# EAGLE design NSE2022 Electro_ESPtest ver.1 (EAGLE 9.6.2)
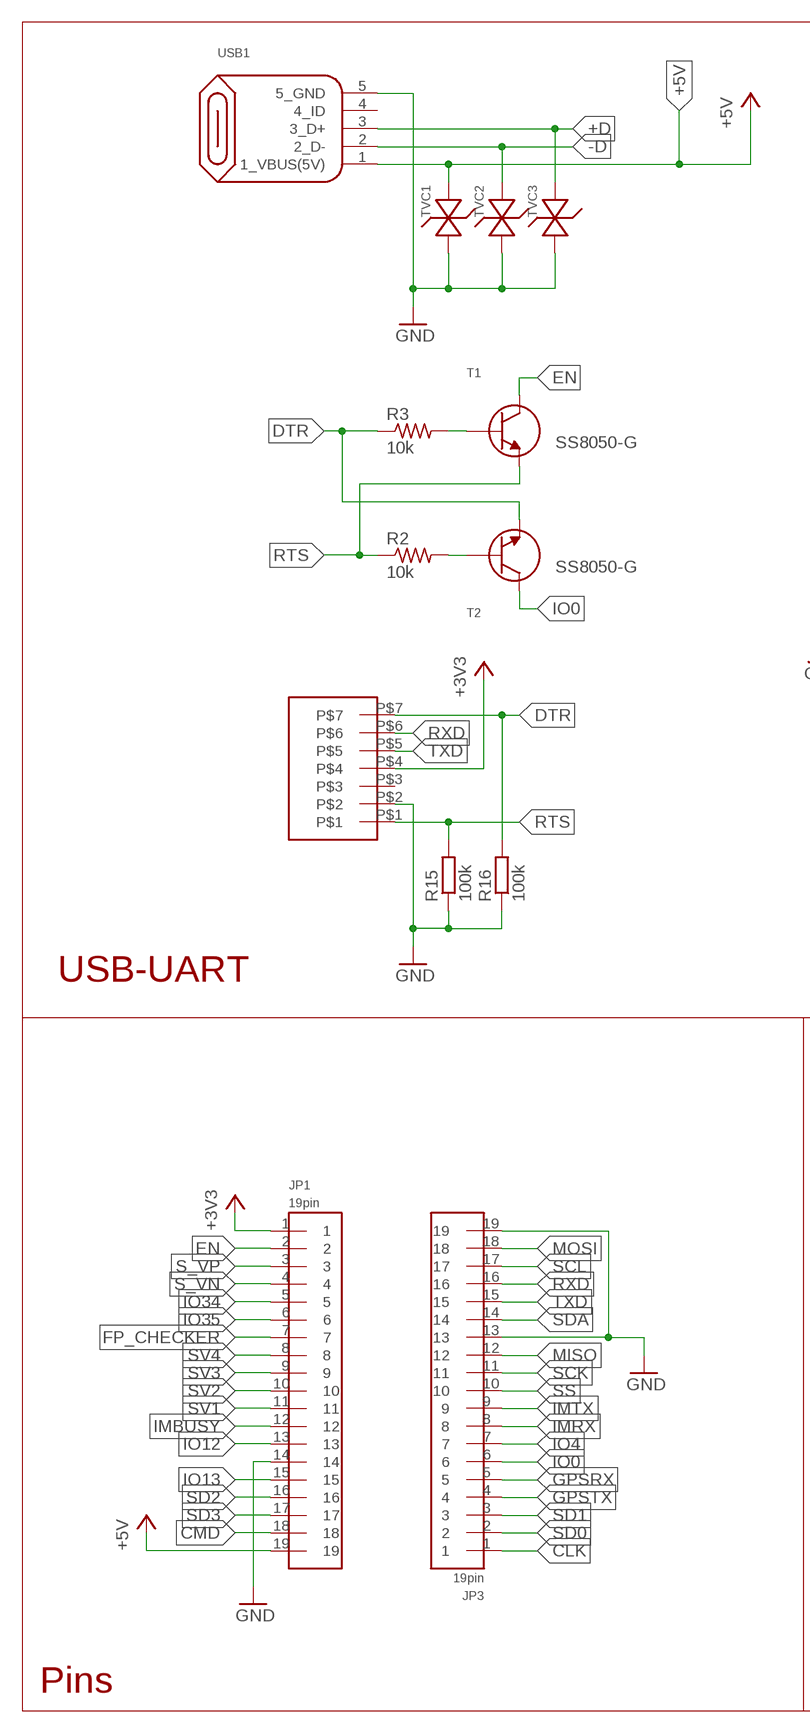
[diagram p0: schematic, sheet 1, part 1 of 2]
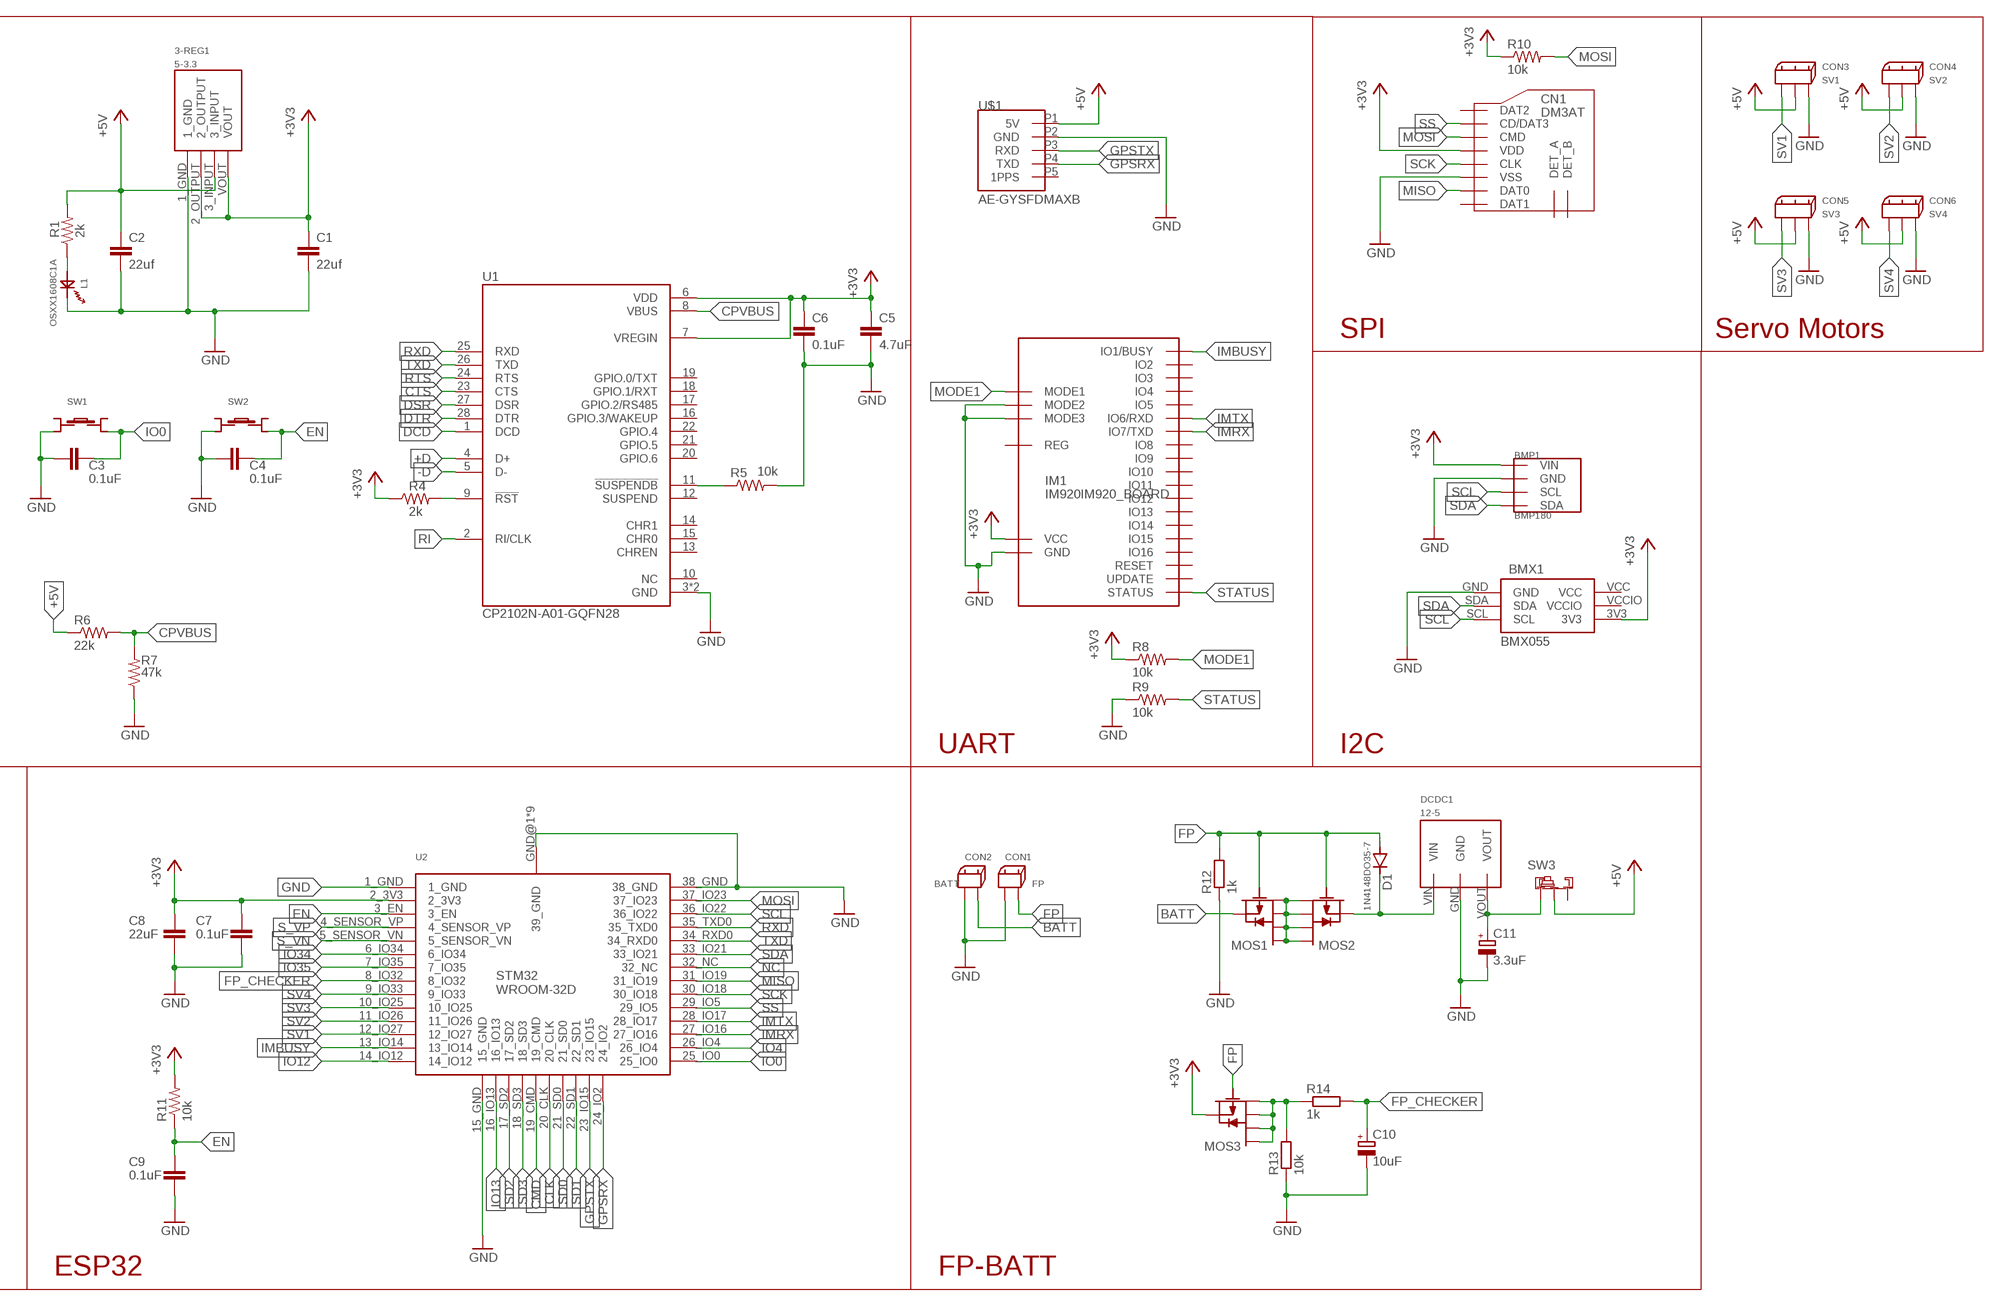
[diagram p1: schematic, sheet 1, part 2 of 2]

## Parts
3-REG1  5-3.3  AZ1117CH-3.3TRG1  [AZ1117CH-3.3TRG1]
BMP1  BMP180  [GY-68]
BMX1  BMX055  [BMX055]
C1  22uf  C-EUC0603  [C0603]
C2  22uf  C-EUC0603  [C0603]
C3  0.1uF  C-EUC0603  [C0603]
C4  0.1uF  C-EUC0603  [C0603]
C5  4.7uF  C-EUC0402  [C0402]
C6  0.1uF  C-EUC0603  [C0603]
C7  0.1uF  C-EUC0603  [C0603]
C8  22uF  C-EUC0603  [C0603]
C9  0.1uF  C-EUC0603  [C0603]
C10  10uF  CPOL-EUE2.5-5  [E2,5-5]
C11  3.3uF  CPOL-EUE2.5-5  [E2,5-5]
CN1  DM3AT  [DM3AT]
CON1  FP  2.5_MINI-SPOX_2PIN  [2.5_MINI-SPOX_2PIN]
CON2  BATT  2.5_MINI-SPOX_2PIN  [2.5_MINI-SPOX_2PIN]
CON3  SV1  2.5_MINI-SPOX_3PIN  [2.5_MINI-SPOX_3PIN]
CON4  SV2  2.5_MINI-SPOX_3PIN  [2.5_MINI-SPOX_3PIN]
CON5  SV3  2.5_MINI-SPOX_3PIN  [2.5_MINI-SPOX_3PIN]
CON6  SV4  2.5_MINI-SPOX_3PIN  [2.5_MINI-SPOX_3PIN]
D1  1N4148DO35-7  [DO35-7]
DCDC1  12-5  5V1A_M78AR05-1  [5V1A_M78AR05-1]
IM1  IM920IM920_BOARD  [IM920_BOARD]
JP1  19pin  19_2.54  [19_2.54]
JP2  7pin  7_2.54  [7_2.54]
JP3  19pin  19_2.54  [19_2.54]
L1  OSXX1608C1A  [OSXX1608C1A]
MOS1  PCH_SSM6J808R  [SSM6J808R]
MOS2  PCH_SSM6J808R  [SSM6J808R]
MOS3  PCH_SSM6J808R  [SSM6J808R]
R1  2k  R-US_R0201  [R0201]
R2  10k  R-US_R0201  [R0201]
R3  10k  R-US_R0201  [R0201]
R4  2k  R-US_R0201  [R0201]
R5  10k  R-US_R0201  [R0201]
R6  22k  R-US_R0201  [R0201]
R7  47k  R-US_R0201  [R0201]
R8  10k  R-US_R0201  [R0201]
R9  10k  R-US_R0201  [R0201]
R10  10k  R-US_R0201  [R0201]
R11  10k  R-US_R0201  [R0201]
R12  1k  R-EU_0207/10  [0207/10]
R13  10k  R-EU_0207/10  [0207/10]
R14  1k  R-EU_0207/10  [0207/10]
R15  100k  R-EU_0207/10  [0207/10]
R16  100k  R-EU_0207/10  [0207/10]
SW1  TS-06104  [TS-06104]
SW2  TS-06104  [TS-06104]
SW3  SRIDE_SWITCH  [SRIDE_SWITCH]
T1  NPN_SS8050-G  [NPN_SS8050-G]
T2  NPN_SS8050-G  [NPN_SS8050-G]
TVC1  ESD5484FCT5G  [ESD5484FCT5G]
TVC2  ESD5484FCT5G  [ESD5484FCT5G]
TVC3  ESD5484FCT5G  [ESD5484FCT5G]
U1  CP2102N-A01-GQFN28  [QFN50P500X500X80-29N]
U2  ESP32-WROOM-32D  [ESP32-WROOM-32D]
U$1  AE-GYSFDMAXB  [AE-GYSFDMAXB]
USB1  MICRO-B_ZX62R-B-5P  [MICRO-B_ZX62R-B-5P]

## Nets
+3V3 [esp]: 3-REG1.2_OUTPUT 3-REG1.VOUT BMP1.P1(VIN) BMX1.3V3 C1.1 C5.1 C6.1 C7.1 C8.1 CN1.VDD IM1.IO23(VCC) JP1.1 JP2.P$4 MOS3.S R4.1 R8.1 R10.1 R11.2 U1.6(VDD) U1.7(VREGIN) U2.2_3V3
+5V [esp]: 3-REG1.3_INPUT C2.1 CON3.2 CON4.2 CON5.2 CON6.2 JP1.19 R1.2 R6.1 SW3.LR TVC1.2_AN U$1.P1(5V) USB1.1(1_VBUS(5V))
+D [esp]: TVC3.2_AN U1.4(D+) USB1.3(3_D+)
-D [esp]: TVC2.2_AN U1.5(D-) USB1.2(2_D-)
BATT: CON2.2 MOS1.S
CLK [esp]: JP3.1 U2.20_CLK
CMD [esp]: JP1.18 U2.19_CMD
CPVBUS [esp]: R6.2 R7.2 U1.8(VBUS)
CTS [esp]: U1.23(CTS)
DCD [esp]: U1.1(DCD)
DSR [esp]: U1.27(DSR)
DTR [esp]: JP2.P$7 R3.1 R16.2 T2.2 U1.28(DTR)
EN [esp]: C4.1 C9.1 JP1.2 R11.1 SW2.D T1.3 U2.3_EN
FP: CON1.2 D1.A MOS1.G MOS2.G MOS3.G R12.2
FP_CHECKER: C10.+ JP1.7 R14.2 U2.8_IO32
GND [esp]: 3-REG1.1_GND BMP1.P2(GND) BMX1.GND C1.2 C2.2 C3.2 C4.2 C5.2 C6.2 C7.2 C8.2 C9.2 C10.- C11.- CN1.VSS CON1.1 CON2.1 CON3.3 CON4.3 CON5.3 CON6.3 DCDC1.GND IM1.IO18(MODE2) IM1.IO19(MODE3) IM1.IO24(GND) JP1.14 JP2.P$2 JP3.13 JP3.19 L1.CT R5.2 R7.1 R9.1 R12.1 R13.1 R15.1 R16.1 SW1.B SW2.B TVC1.1_CT TVC2.1_CT TVC3.1_CT U1.3(GND) U1.29(GND) U2.1_GND U2.15_GND U2.38_GND U2.GND@1(39_GND) U2.GND@2(39_GND) U2.GND@3(39_GND) U2.GND@4(39_GND) U2.GND@5(39_GND) U2.GND@6(39_GND) U2.GND@7(39_GND) U2.GND@8(39_GND) U2.GND@9(39_GND) U$1.P2(GND) USB1.5(5_GND)
GPSRX: JP3.5 U2.24_IO2 U$1.P4(TXD)
GPSTX: JP3.4 U2.23_IO15 U$1.P3(RXD)
IMBUSY: IM1.IO1(IO1/BUSY) JP1.12 U2.13_IO14
IMRX: IM1.IO7(IO7/TXD) JP3.8 U2.27_IO16
IMTX: IM1.IO6(IO6/RXD) JP3.9 U2.28_IO17
IO0 [esp]: C3.1 JP3.6 SW1.D T2.3 U2.25_IO0
IO4 [esp]: JP3.7 U2.26_IO4
IO12 [esp]: JP1.13 U2.14_IO12
IO13 [esp]: JP1.15 U2.16_IO13
IO34 [esp]: JP1.5 U2.6_IO34
IO35 [esp]: JP1.6 U2.7_IO35
MISO: CN1.DAT0 JP3.12 U2.31_IO19
MODE1: IM1.IO17(MODE1) R8.2
MOSI: CN1.CMD JP3.18 R10.2 U2.37_IO23
N$1 [esp]: L1.AN R1.1
N$2 [esp]: R3.2 T1.1
N$5 [esp]: R2.2 T2.1
N$8 [esp]: R4.2 U1.9(!RST)
N$10 [esp]: R5.1 U1.11(!SUSPENDB)
N$11: D1.C DCDC1.VIN MOS2.S
N$12: MOS1.D1 MOS1.D2 MOS1.D3 MOS1.D4 MOS2.D1 MOS2.D2 MOS2.D3 MOS2.D4
N$13: C11.+ DCDC1.VOUT SW3.L
N$14: MOS3.D1 MOS3.D2 MOS3.D3 MOS3.D4 R13.2 R14.1
NC [esp]: U2.32_NC
RI [esp]: U1.2(RI/CLK)
RTS [esp]: JP2.P$1 R2.1 R15.2 T1.2 U1.24(RTS)
RXD [esp]: JP2.P$6 JP3.16 U1.25(RXD) U2.35_TXD0
S_VN [esp]: JP1.4 U2.5_SENSOR_VN
S_VP [esp]: JP1.3 U2.4_SENSOR_VP
SCK: CN1.CLK JP3.11 U2.30_IO18
SCL: BMP1.P3(SCL) BMX1.SCL JP3.17 U2.36_IO22
SD0 [esp]: JP3.2 U2.21_SD0
SD1 [esp]: JP3.3 U2.22_SD1
SD2 [esp]: JP1.16 U2.17_SD2
SD3 [esp]: JP1.17 U2.18_SD3
SDA: BMP1.P4(SDA) BMX1.SDA JP3.14 U2.33_IO21
SS: CN1.CD/DAT3 JP3.10 U2.29_IO5
STATUS: IM1.IO21(STATUS) R9.2
SV1: CON3.1 JP1.11 U2.12_IO27
SV2: CON4.1 JP1.10 U2.11_IO26
SV3: CON5.1 JP1.9 U2.10_IO25
SV4: CON6.1 JP1.8 U2.9_IO33
TXD [esp]: JP2.P$5 JP3.15 U1.26(TXD) U2.34_RXD0
Unconnected: CN1.DAT1 CN1.DAT2 CN1.DET_A CN1.DET_B IM1.IO2 IM1.IO3 IM1.IO4 IM1.IO5 IM1.IO8 IM1.IO9 IM1.IO10 IM1.IO11 IM1.IO12 IM1.IO13 IM1.IO14 IM1.IO15 IM1.IO16 IM1.IO20(UPDATE) IM1.IO22(REG) IM1.IO25(RESET) JP2.P$3 SW1.A SW1.C SW2.A SW2.C SW3.R U1.10(NC) U1.12(SUSPEND) U1.13(CHREN) U1.14(CHR1) U1.15(CHR0) U1.16(GPIO.3/WAKEUP) U1.17(GPIO.2/RS485) U1.18(GPIO.1/RXT) U1.19(GPIO.0/TXT) U1.20(GPIO.6) U1.21(GPIO.5) U1.22(GPIO.4) U$1.P5(1PPS) USB1.4(4_ID)

## Notes on the sheet
- SS8050-G | SPI | Servo Motors
- SS8050-G
- USB-UART
- UART | I2C
- Pins | ESP32 | FP-BATT

## Power pins joined to a net without a drawn wire
VCC: BMX1.VCC
VCCIO: BMX1.VCCIO

## Library data of the parts
3-REG1 = Chip 3-Terminal Regulator:AZ1117CH-3.3TRG1
BMP1 = BMP180:BMP180
BMX1 = BMX055:BMX055
C1-C9 = rcl:C-EU: CAPACITOR, European symbol; SPICEPREFIX: C
C10 C11 = rcl:CPOL-EU: POLARIZED CAPACITOR, European symbol; SPICEPREFIX: C
CN1 = microSD:DM3AT
CON1 CON2 = Connector:2.5_MINI-SPOX_2PIN
CON3-CON6 = Connector:2.5_MINI-SPOX_3PIN
D1 = diode:1N4148: DIODE high speed (Philips)
DCDC1 = DC-DC:5V1A_M78AR05-1
IM1 = IM920:IM920
JP1 JP3 = JumperPins:19_2.54
JP2 = JumperPins:7_2.54
L1 = ChipLED:OSXX1608C1A
MOS1-MOS3 = Chip MOSFET:PCH_SSM6J808R
R1-R11 = rcl:R-US_: RESISTOR, American symbol; SPICEPREFIX: R
R12-R16 = rcl:R-EU_: RESISTOR, European symbol; SPICEPREFIX: R
SW1 SW2 = Switches:TS-06104
SW3 = Switches:SRIDE_SWITCH
T1 T2 = Chip Transister:NPN_SS8050-G
TVC1-TVC3 = TVC Diode:ESD5484FCT5G
U1 = CP2102N-A01-GQFN28:CP2102N-A01-GQFN28: USB Bridge, USB to UART USB 2.0 UART Interface 28-QFN (5x5) Check availability <https://pricing.snapeda.com/parts/CP2102N-A01-GQFN28/Silicon%20Labs/view-part?ref=eda>; AVAILABILITY: In Stock; DESCRIPTION: USB Bridge, USB to UART USB 2.0 UART Interface 28-QFN (5x5); MF: Silicon Labs; MP: CP2102N-A01-GQFN28; PACKAGE: QFN-28 Silicon Labs; PRICE: None; PURCHASE-URL: https://pricing.snapeda.com/search/part/CP2102N-A01-GQFN28/?ref=eda
U2 = ESP32:ESP32-WROOM-32D
U$1 = AE-GYSFDMAXB:AE-GYSFDMAXB
USB1 = USB:MICRO-B_ZX62R-B-5P

## Net classes
0 default: drill 0.35 mm
1 esp: width 0.254 mm, drill 0.35 mm, clearance 0.025 mm

## Board
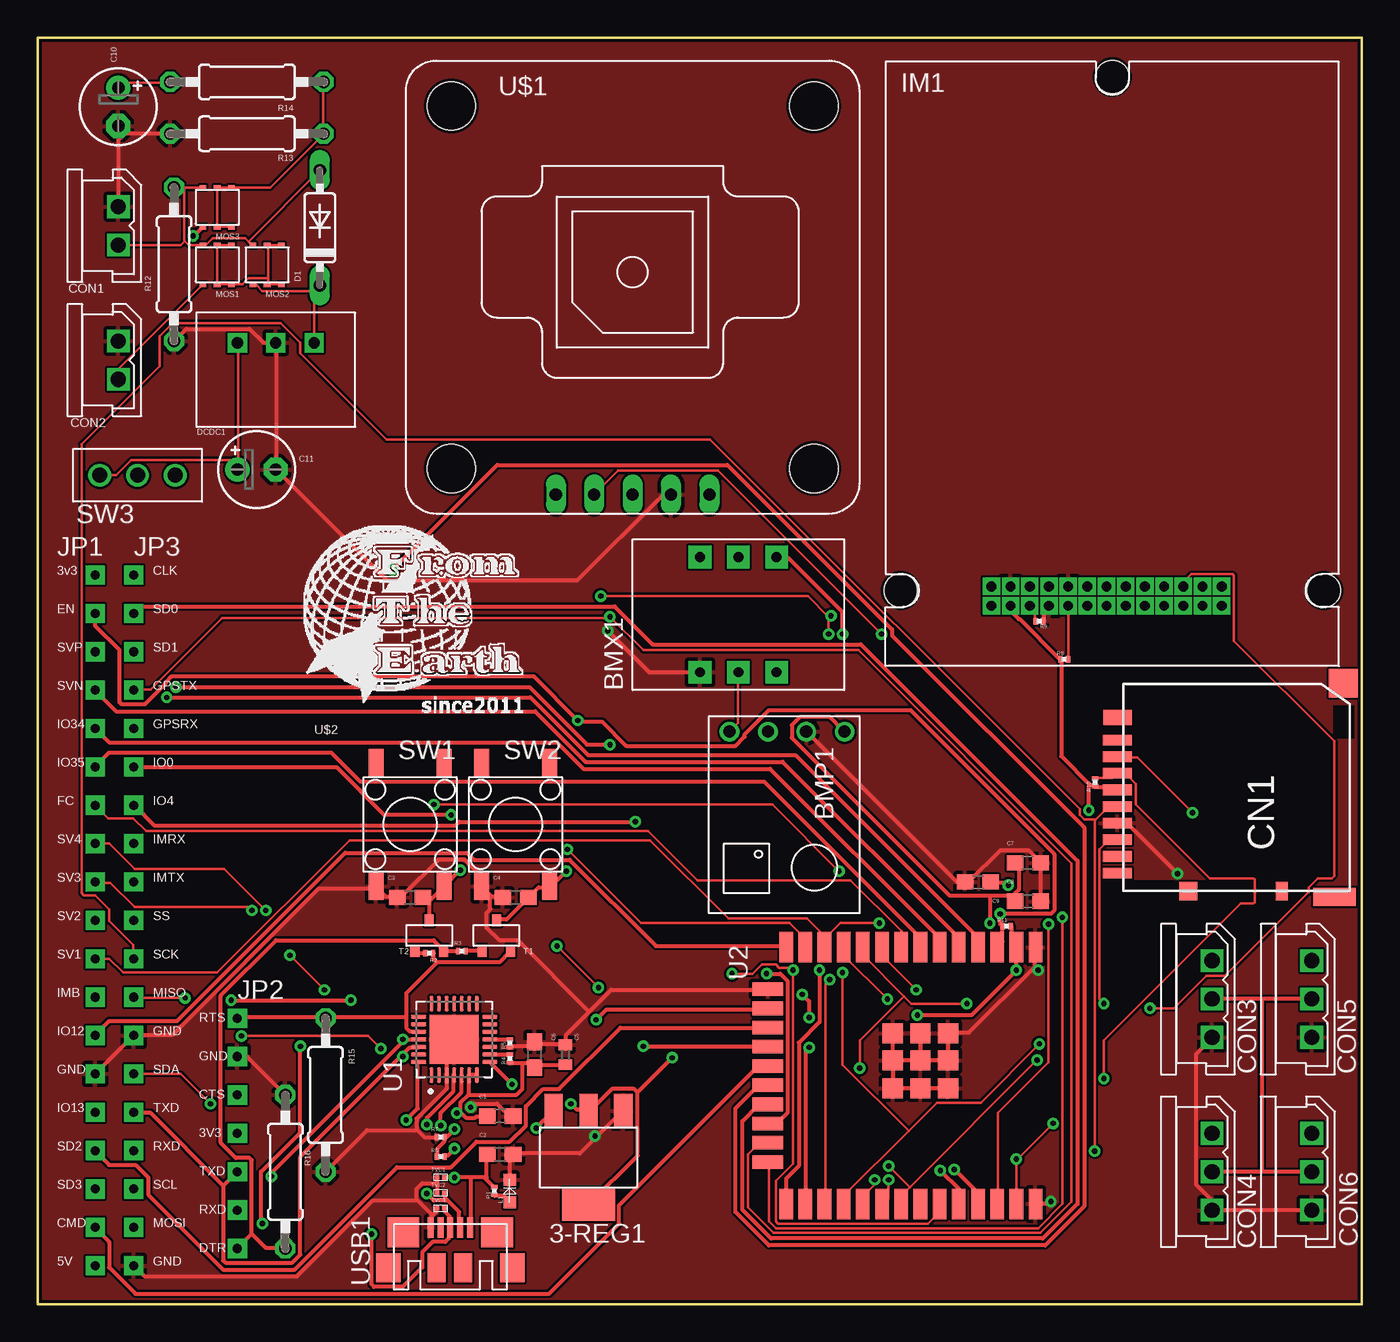
[diagram p2: board, top side]
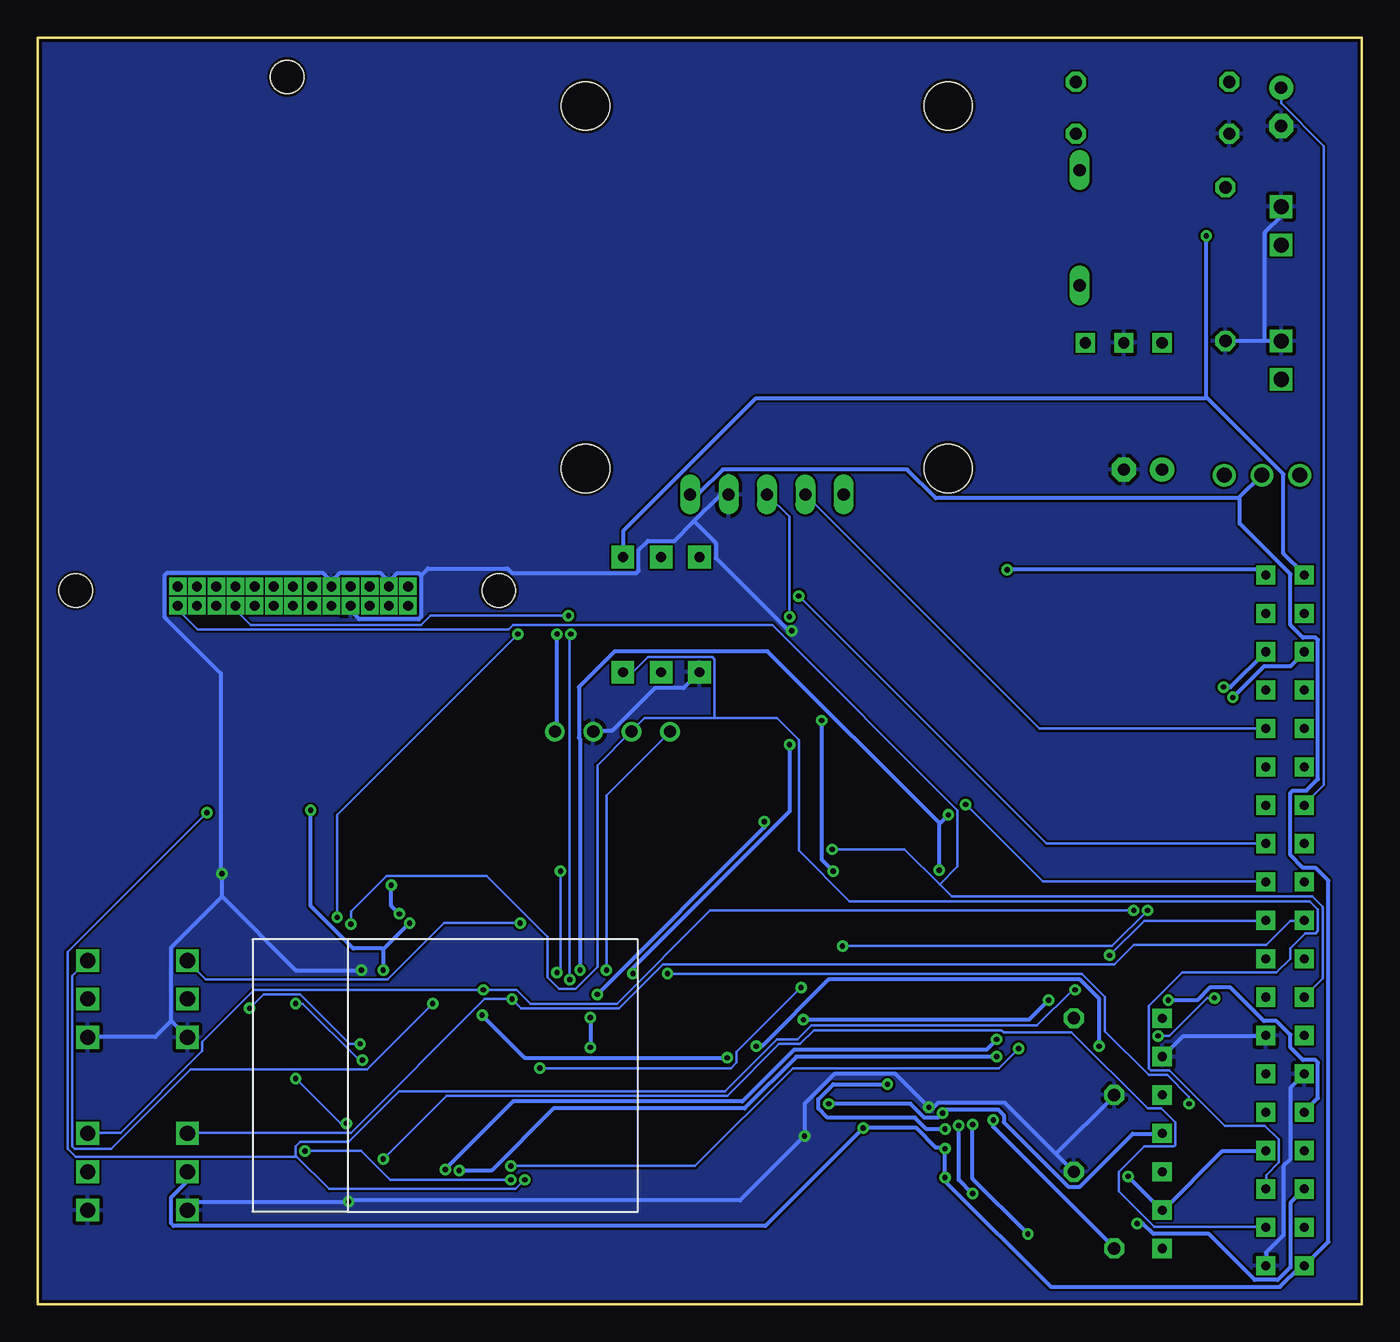
[diagram p3: board, bottom side, seen from below]

Size 87.63 x 83.82 mm. Coordinates in mm from the lower left corner, seen from the top.
Outline: 0,0 0,83.82 87.63,83.82 87.63,0 0,0
Copper layers (1*16): Top 0.035mm / dielectric 1.5mm / Bottom 0.035mm
Design rules "PCBGoGo": minimum track width 6mil, minimum drill 0.2mm, track to track 6mil, track to pad 6mil, pad to pad 6mil, via to via 6mil, smd to smd 6mil, copper to edge 0.2mm, drill to drill 6mil, minimum pad ring 10mil, minimum via ring 8mil, stop-mask expansion 4mil, vias tented up to drill 0mil, thermal gap 10mil

### Footprints (pad centres in the part's own frame; a part is rotated, then mirrored left to right if it is on the bottom)
AZ1117CH-3.3TRG1 = smd 1.2 x 2.2: 1_GND -2.3,-6.2; 2_OUTPUT 0,-6.2; 3_INPUT 2.3,-6.2 | smd 3.5 x 2.2: VOUT 0,0
GY-68 = drill 0.8: P1 -5,4; P2 -5,1.46; P3 -5,-1.08; P4 -5,-3.62
BMX055 = drill 0.65 pad 1.5 square: 3V3 8.81,-9.53; GND 1.19,-4.46; SCL 1.19,-9.53; SDA 1.19,-7; VCC 8.81,-4.46; VCCIO 8.81,-7
C0603 = smd 1.1 x 1: 1 -0.85,0; 2 0.85,0
C0402 = smd 0.7 x 0.9: 1 -0.65,0; 2 0.65,0
E2,5-5 = drill 0.813 pad 1.6: + -1.27,0 | drill 0.813 pad 1.6 octagon: - 1.27,0
DM3AT = smd 0.7 x 1.9: CD/DAT3 2.2,6.4; CLK -1.1,6.4; CMD 1.1,6.4; DAT0 -3.3,6.4; DAT1 -4.4,6.4; DAT2 3.3,6.4; DET_B -5.5,6.4; VDD 0,6.4; VSS -2.2,6.4 | smd 1.2 x 0.8: DET_A -6.7,-4.5 | smd 1 x 1.9: P$9 4.8,6.381 | smd 1.2 x 1.2: P$11 -6.7,1.7 | smd 1.2 x 2.8: P$13 -7.081,-7.973 | smd 1.9 x 1.9: P$14 7.054,-8.562
2.5_MINI-SPOX_2PIN = drill 1 square: 1 -1.27,0; 2 1.27,0
2.5_MINI-SPOX_3PIN = drill 1 square: 1 -1.27,0; 2 1.27,0; 3 3.81,0
DO35-7 = drill 0.813 long: A 3.81,0; C -3.81,0
5V1A_M78AR05-1 = drill 0.75 pad 1.27 square: GND 0,0; VIN 2.54,0; VOUT -2.54,0
IM920_BOARD = drill 0.65 pad 0.813 square: IO1 7.24,-17.27; IO2 7.24,-16; IO3 5.97,-17.27; IO4 5.97,-16; IO5 4.7,-17.27; IO6 4.7,-16; IO7 3.43,-17.27; IO8 3.43,-16; IO9 2.16,-17.27; IO10 2.16,-16; IO11 0.89,-17.27; IO12 0.89,-16; IO13 -0.38,-17.27; IO14 -0.38,-16; IO15 -1.65,-17.27; IO16 -1.65,-16; IO17 -2.92,-17.27; IO18 -2.92,-16; IO19 -4.19,-17.27; IO20 -4.19,-16; IO21 -5.46,-17.27; IO22 -5.46,-16; IO23 -6.73,-17.27; IO24 -6.73,-16; IO25 -8,-17.27; IO26 -8,-16 | hole 2.2: -14,-16.27; 14,-16.27; 0,17.73
19_2.54 = drill 0.6 pad 1.27 square: 1 0,12.7; 2 0,10.16; 3 0,7.62; 4 0,5.08; 5 0,2.54; 6 0,0; 7 0,-2.54; 8 0,-5.08; 9 0,-7.62; 10 0,-10.16; 11 0,-12.7; 12 0,-15.24; 13 0,-17.78; 14 0,-20.32; 15 0,-22.86; 16 0,-25.4; 17 0,-27.94; 18 0,-30.48; 19 0,-33.02
7_2.54 = drill 0.6 pad 1.27 square: P$1 0,7.62; P$2 0,5.08; P$3 0,2.54; P$4 0,0; P$5 0,-2.54; P$6 0,-5.08; P$7 0,-7.62
OSXX1608C1A = smd 0.8 x 0.8: AN -0.75,0; CT 0.75,0
SSM6J808R = smd 0.44 x 0.33: D1 0,0; D2 0.95,0; D3 0.01,2.64; D4 0.95,2.64; G 1.9,0; S 1.9,2.64
R0201 = smd 0.28 x 0.43: 1 -0.255,0; 2 0.255,0
0207/10 = drill 0.813 octagon: 1 -5.08,0; 2 5.08,0
TS-06104 = smd 1 x 1.8: A -2.25,4.1; B -2.25,-4.1; C 2.25,4.1; D 2.25,-4.1
SRIDE_SWITCH = drill 1: L -2.5,0; LR 0,0; R 2.5,0
NPN_SS8050-G = smd 0.6 x 0.8: 1 -0.95,-2.02; 2 0.95,-2.02; 3 0,0
ESD5484FCT5G = smd 0.28 x 0.3: 1_CT -0.235,0; 2_AN 0.235,0
QFN50P500X500X80-29N = smd 1.01 x 0.27: 1 -2.36,1.5; 2 -2.36,1; 3 -2.36,0.5; 4 -2.36,0; 5 -2.36,-0.5; 6 -2.36,-1; 7 -2.36,-1.5; 15 2.36,-1.5; 16 2.36,-1; 17 2.36,-0.5; 18 2.36,0; 19 2.36,0.5; 20 2.36,1; 21 2.36,1.5 | smd 0.27 x 1.01: 8 -1.5,-2.36; 9 -1,-2.36; 10 -0.5,-2.36; 11 0,-2.36; 12 0.5,-2.36; 13 1,-2.36; 14 1.5,-2.36; 22 1.5,2.36; 23 1,2.36; 24 0.5,2.36; 25 0,2.36; 26 -0.5,2.36; 27 -1,2.36; 28 -1.5,2.36 | smd 3.25 x 3.25: 29 0,0
ESP32-WROOM-32D = smd 2 x 0.9: 1_GND -7.5,7.62; 2_3V3 -7.5,6.35; 3_EN -7.5,5.08; 4_SENSOR_VP -7.5,3.81; 5_SENSOR_VN -7.5,2.54; 6_IO34 -7.5,1.27; 7_IO35 -7.5,0; 8_IO32 -7.5,-1.27; 9_IO33 -7.5,-2.54; 10_IO25 -7.5,-3.81; 11_IO26 -7.5,-5.08; 12_IO27 -7.5,-6.35; 13_IO14 -7.5,-7.62; 14_IO12 -7.5,-8.89; 25_IO0 9.5,-8.89; 26_IO4 9.5,-7.62; 27_IO16 9.5,-6.35; 28_IO17 9.5,-5.08; 29_IO5 9.5,-3.81; 30_IO18 9.5,-2.54; 31_IO19 9.5,-1.27; 32_NC 9.5,0; 33_IO21 9.5,1.27; 34_RXD0 9.5,2.54; 35_TXD0 9.5,3.81; 36_IO22 9.5,5.08; 37_IO23 9.5,6.35; 38_GND 9.5,7.62 | smd 0.9 x 2: 15_GND -4.715,-10.1; 16_IO13 -3.445,-10.1; 17_SD2 -2.175,-10.1; 18_SD3 -0.905,-10.1; 19_CMD 0.365,-10.1; 20_CLK 1.635,-10.1; 21_SD0 2.905,-10.1; 22_SD1 4.175,-10.1; 23_IO15 5.445,-10.1; 24_IO2 6.715,-10.1 | smd 1.33 x 1.33: GND@1 -1.8,1.835; GND@2 0,1.835; GND@3 1.835,1.835; GND@4 -1.8,0; GND@5 0,0; GND@6 1.835,0; GND@7 -1.8,-1.835; GND@8 0,-1.835; GND@9 1.835,-1.835
AE-GYSFDMAXB = drill 0.8 long: P1 13.716,5.08; P2 13.716,2.54; P3 13.716,0; P4 13.716,-2.54; P5 13.716,-5.08 | hole 3.2: -12,12; 12,12; 12,-12; -12,-12
MICRO-B_ZX62R-B-5P = smd 0.4 x 1.35: 1 1.3,0; 2 0.65,0; 3 0,0; 4 -0.65,0; 5 -1.3,0 | smd 2.1 x 2: P$6 3.1,-0.325; P$7 -3.1,-0.325 | smd 1.6 x 1.9: P$8 -4.1,-2.675; P$9 4.1,-2.675 | smd 1.2 x 1.9: P$10 0.85,-2.675; P$11 -0.9,-2.675

### Placement (x,y rotation side)
3-REG1  36.45,6.6 180 top
BMP1  49.4,32.89 270 top
BMX1  39.37,40.64 90 top
C1  30.61,12.45 0 top
C2  30.61,9.91 0 top
C3  24.64,26.92 180 top
C4  31.62,26.92 180 top
C5  34.92,16.51 90 top
C6  32.89,16.51 90 top
C7  65.53,29.21 0 top
C8  65.53,26.67 0 top
C9  62.23,27.94 180 top
C10  5.33,79.25 270 top
C11  14.48,55.24 0 top
CN1  77.85,34.04 90 top
CON1  5.33,71.37 270 top
CON2  5.33,62.48 270 top
CON3  77.72,21.46 270 top
CON4  77.72,10.03 270 top
CON5  84.33,21.46 270 top
CON6  84.33,10.03 270 top
D1  18.67,71.25 90 top
DCDC1  15.75,63.63 0 top
IM1  71.12,63.5 0 top
JP1  3.81,35.56 0 top
JP2  13.21,11.3 0 top
JP3  6.35,35.56 0 top
L1  31.24,7.49 90 top
MOS1  12.83,70.1 180 top
MOS2  16.13,70.1 180 top
MOS3  12.83,73.91 180 top
R1  30.23,7.49 90 top
R2  25.91,23.24 180 top
R3  28.07,23.37 0 top
R4  31.24,16.26 90 top
R5  31.24,17.27 270 top
R6  26.67,9.78 180 top
R7  26.67,11.05 0 top
R8  67.94,42.67 0 top
R9  66.29,45.21 180 top
R10  69.98,34.54 90 top
R11  64.14,25.02 0 top
R12  9.02,68.83 90 top
R13  13.84,77.47 0 top
R14  13.84,80.9 180 top
R15  19.05,13.84 90 top
R16  16.38,8.76 270 top
SW1  24.64,31.75 0 top
SW2  31.62,31.75 0 top
SW3  6.6,54.86 0 top
T1  30.35,25.4 0 top
T2  25.91,25.4 0 top
TVC1  26.67,8.38 0 top
TVC2  26.67,7.37 0 top
TVC3  26.67,6.35 0 top
U1  27.56,17.53 90 top
U2  58.42,16.13 270 top
U$1  39.37,67.31 270 top
U$2  [LOGO]  17.02,37.72 0 top
USB1  27.3,5.08 0 top

### Tracks (layer width: path | path; a pad name or v marks a point on that pad's centre or on a via)
+3V3  (via drill 0.35)
  Top 0.254: 39.7,14.02 39.47,14.25 38.02,14.25 36.65,12.88 36.5,12.88 3-REG1.2_OUTPUT 36.35,12.88 35.66,12.88 v35.28,13.26 | 39.7,14.02 39.7,9.83 36.5,6.63 3-REG1.VOUT | 32.08,15.93 32.61,15.93 32.84,15.7 C6.1 32.99,15.7 33.15,15.85 34.9,15.85 C5.1 | 32.08,15.93 31.24,15.93 R4.1 | U1.7 29.03,15.16 28.57,15.16 U1.6 28.5,15.09 28.5,13.87 | 27.96,12.72 28.35,12.34 28.96,12.34 29.03,12.42 29.72,12.42 C1.1 | 27.96,12.72 27.96,13.34 28.5,13.87 | 32.08,15.93 32.08,14.25 31.7,13.87 28.5,13.87 | v27.74,12.65 27.89,12.65 27.96,12.72 | v10.29,70.71 10.36,70.71 10.9,71.25 MOS3.S | CN1.VDD 71.4,34.06 71.25,34.21 70.03,34.21 R10.1 69.88,34.37 69.65,34.37 | IM1.IO23 64.47,46.18 64.47,45.8 64.92,45.34 65,45.34 67.67,42.67 R8.1 67.74,42.6 67.74,36.27 69.65,34.37 | R11.2 64.47,24.99 64.47,24 64.77,23.7 U2.2_3V3 v64.77,22.1 61.8,19.13 v58.22,19.13 | C7.1 64.69,29.18 64.92,28.96 64.92,27.43 64.69,27.2 64.69,26.67 C8.1 64.62,27.05 63.02,27.05 | 63.02,27.05 60.35,27.05 49.91,37.49 49.91,38.33 50.44,38.86 52.43,38.86 53.34,37.95 BMP1.P1 | 63.02,27.05 v63.02,25.22 | v53.26,44.35 53.26,45.8 49.68,49.38 48.92,49.38 BMX1.3V3 | v69.57,32.69 69.57,34.29 69.65,34.37 | v41.99,16.31 39.7,14.02
  Bottom 0.254: JP2.P$4 13.26,11.28 15.16,11.28 18.67,7.77 19.43,7.77 23.7,12.04 23.7,12.5 24.08,12.88 27.51,12.88 v27.74,12.65 28.04,12.34 28.96,12.34 29.87,13.26 v35.28,13.26 | 10.29,60.05 v10.29,70.71 | 10.29,60.05 5.18,54.94 5.18,49.68 3.81,48.31 JP1.1 | 64.77,23.47 v64.77,22.1 | v63.02,25.22 64.77,23.47 | v53.26,44.35 53.26,38.02 53.34,37.95 BMP1.P1 | v69.57,32.69 69.57,26.36 66.75,23.55 64.85,23.55 64.77,23.47 | 10.29,60.05 10.36,59.97 40.08,59.97 48.84,51.21 48.84,49.45 BMX1.3V3 | v41.99,16.31 55.4,16.31 v58.22,19.13
+5V  (via drill 0.35)
  Top 0.254: CON6.2 81,8.76 | 81,8.76 CON4.2 | CON5.2 81,20.19 | 81,20.19 CON3.2 | 81,20.19 81,8.76 | 28.65,8.38 29.57,8.38 29.64,8.31 | 28.65,8.38 v27.58,8.38 TVC1.2_AN | 29.64,8.31 30.18,7.77 R1.2 | v27.58,10.29 27.13,9.83 26.98,9.83 R6.1 | C2.1 29.72,9.91 29.72,8.38 29.64,8.31 | 28.65,8.38 28.65,5.11 USB1.1 | v32.99,11.66 34.14,12.8 3-REG1.3_INPUT
  Bottom 0.254: 8.15,53.34 28.19,53.34 30.1,55.24 42.29,55.24 43.89,53.65 44.42,53.65 U$1.P1 | 8.15,53.34 6.63,54.86 SW3.LR | CON4.2 77.72,8.15 78.79,7.09 78.79,5.33 78.64,5.18 39.47,5.18 v32.99,11.66 29.49,11.66 28.19,10.36 27.66,10.36 v27.58,10.29 v27.58,8.38 27.51,8.31 27.51,8.08 20.57,1.14 5.41,1.14 4.04,2.52 3.81,2.52 JP1.19 3.73,2.59 2.21,4.12 2.21,28.04 3.05,28.88 3.89,28.88 4.72,29.72 4.72,33.83 4.57,33.98 3.66,33.98 2.9,34.75 2.9,43.97 3.05,44.12 3.89,44.12 4.72,44.96 4.72,48.31 8.08,51.66 8.08,53.26 8.15,53.34
+D  (via drill 0.35)
  Top 0.254: TVC3.2_AN 26.98,6.33 26.98,6.1 27.28,5.79 27.28,5.11 USB1.3 27.2,5.03 27.2,4.34 26.98,4.12 26.14,4.12 25.45,3.43 25.45,2.44 24.16,1.14 22.25,1.14 22.1,1.29 v22.1,4.65 | v25.76,11.89 25.76,12.34 27.51,14.1 27.51,15.16 U1.4
  Bottom 0.254: v25.76,11.89 25.76,8.31 v22.1,4.65
-D  (via drill 0.35)
  Top 0.254: 27.05,6.93 27.89,6.1 27.89,5.11 USB1.2 | 27.05,6.93 26.98,7.01 26.98,7.32 TVC2.2_AN | v26.67,11.81 26.67,12.65 28.04,14.02 28.04,15.16 U1.5 | v25.76,7.32 26.21,6.86 26.98,6.86 27.05,6.93
  Bottom 0.254: v26.67,11.81 26.67,8.23 v25.76,7.32
BATT
  Top 0.152: CON2.2 5.33,61.87 10.9,67.44 MOS1.S
CLK  (via drill 0.35)
  Top 0.254: v23.47,48.62 30.4,55.55 45.64,55.55 56.54,44.65 56.54,44.27 69.27,31.55 69.27,6.48 66.67,3.89 48.39,3.89 46.18,6.1 46.18,12.95 47.7,14.48 48.31,14.48 U2.20_CLK
  Bottom 0.254: v23.47,48.62 6.71,48.62 JP3.1
CMD
  Top 0.254: U2.19_CMD 48.31,15.7 47.62,15.7 38.48,6.55 38.48,5.33 33.83,0.69 6.48,0.69 4.72,2.44 4.72,4.12 3.81,5.03 JP1.18
CPVBUS  (via drill 0.35)
  Top 0.254: R6.2 26.44,9.83 26.44,10.29 26.9,10.74 26.9,11.05 R7.2 27.05,11.05 v27.58,11.58 | v31.39,14.55 29.95,16 U1.8
  Bottom 0.254: v31.39,14.55 34.98,14.55 35.97,13.56 35.97,12.95 35.36,12.34 29.57,12.34 28.8,11.58 v27.58,11.58
DTR  (via drill 0.35)
  Top 0.254: v24.38,12.19 25.15,12.95 25.15,16 U1.28 | R3.1 27.74,23.39 26.9,23.39 T2.2 26.82,23.47 26.21,24.08 15.77,24.08 12.12,20.42 12.12,10.67 13.11,9.68 14.02,9.68 14.17,9.53 14.17,4.65 | JP2.P$7 14.17,4.65 | 14.17,4.65 15.09,3.73 16.38,3.73 R16.2
  Bottom 0.254: v24.38,12.19 24.38,11.73 16.38,3.73 R16.2
EN  (via drill 0.35)
  Top 0.254: U2.3_EN 63.55,23.7 63.86,24 63.86,24.99 R11.1 63.78,25.07 63.7,25.15 v63.7,25.83 67.06,25.83 67.28,26.06 67.28,29.79 57.76,39.32 48.39,39.32 46.79,37.72 46.79,37.57 46.18,36.96 38.94,36.96 37.34,38.56 35.81,38.56 v35.74,38.63 32.84,41.53 8.84,41.53 8.46,41.15 8.46,41.07 7.09,39.7 5.56,39.7 5.41,39.85 5.41,43.28 3.81,44.88 JP1.2 | v64.24,27.74 64.08,27.89 63.09,27.89 C9.1 | T1.3 30.4,25.45 31.01,25.45 32.46,26.9 C4.1 32.54,26.98 33.15,27.58 33.83,27.58 SW2.D 33.98,27.66 v34.98,28.65
  Bottom 0.254: v64.24,27.74 64.24,26.36 v63.7,25.83 | v35.74,38.63 35.74,29.41 v34.98,28.65
FP
  Top 0.152: 13.95,70.33 14.17,70.1 MOS2.G | 13.95,70.33 13.72,70.56 11.58,70.56 11.12,70.1 MOS1.G 9.98,70.1 9.72,70.37 | R12.2 9.68,73.91 | 9.68,73.91 MOS3.G | 9.72,70.37 9.68,70.41 9.68,73.91 | 13.95,70.33 D1.A | CON1.2 9.45,70.1 9.72,70.37
FP_CHECKER
  Top 0.152: R14.2 8.76,80.85 5.64,80.85 5.33,80.54 C10.+ | U2.8_IO32 57.15,24.69 53.8,28.04 43.66,28.04 40.39,31.32 7.16,31.32 6.33,32.16 4.65,32.16 3.81,32.99 JP1.7
  Bottom 0.152: C10.+ 5.33,79.48 2.52,76.66 2.52,34.37 3.81,33.07 JP1.7
GND  (via drill 0.35)
  Top 0.254: v67.06,6.78 66.9,6.63 66.06,6.63 U2.38_GND | CON6.3 84.28,6.25 77.72,6.25 CON4.3 77.65,6.33 77.65,6.93 76.66,7.92 76.66,16.54 77.72,17.6 CON3.3 | U2.GND@8 56.62,16.08 56.62,14.33 U2.GND@9 56.69,14.33 58.37,14.33 U2.GND@6 58.52,14.33 60.2,14.33 U2.GND@3 | U2.GND@7 56.62,17.91 56.62,16.23 U2.GND@8 | U2.GND@5 58.37,16.15 56.69,16.15 U2.GND@8 | U2.GND@4 58.45,17.91 58.45,16.23 U2.GND@5 | U2.GND@5 58.52,16.15 60.2,16.15 U2.GND@2 60.27,16.23 60.27,17.91 U2.GND@1 60.35,17.98 61.65,17.98 65.99,22.33 | 65.99,22.33 65.99,23.62 U2.1_GND | v75.44,28.5 72.16,31.77 71.48,31.77 CN1.VSS | v66.22,22.1 65.99,22.33 | 30.02,26.98 30.71,26.98 C4.2 | 30.02,26.98 29.41,27.58 SW2.B 29.34,27.74 29.34,28.35 28.27,29.41 26.52,29.41 24.16,27.05 23.85,27.05 C3.2 23.77,26.98 23.01,26.98 22.4,27.58 SW1.B 22.33,27.51 18.59,27.51 8.91,17.83 6.4,17.83 JP3.13 JP1.14 | R5.2 31.24,17.07 32.61,17.07 32.84,17.3 C6.2 32.92,17.22 34.9,17.22 C5.2 34.98,17.3 34.98,17.83 36.5,19.36 | 36.5,19.36 37.95,20.8 48.31,20.8 U2.15_GND | 36.5,19.36 31.77,24.08 30.56,24.08 29.72,24.92 29.72,25.91 29.95,26.14 29.95,26.9 30.02,26.98 | 26.44,8 TVC1.1_CT | 26.44,8 26.44,7.39 TVC2.1_CT | 26.14,5.87 26.06,5.79 26.06,5.11 USB1.5 | 26.14,5.87 26.36,6.1 26.36,6.33 TVC3.1_CT | 26.44,8 25.45,8 25.07,7.62 25.07,6.93 | 26.14,5.87 25.07,6.93 | 25.07,6.93 24.99,6.86 22.17,6.86 17.14,1.83 7.09,1.83 6.4,2.52 JP3.19 | JP2.P$2 13.87,16.38 16.38,13.87 R16.1 | L1.CT 31.24,9.75 31.39,9.91 C2.2 31.55,9.98 35.89,9.98 36.96,11.05 | 36.96,11.05 38.71,12.8 3-REG1.1_GND | R7.1 25.6,11.05 25.07,11.58 | 25.07,11.58 25.07,12.27 27.05,14.25 U1.3 27.05,15.24 27.05,17.07 27.51,17.53 U1.29
  Top 0.254: v28.65,13.03 28.88,13.26 30.4,13.26 31.17,12.5 31.39,12.5 C1.2 | R15.1 21.79,11.51 24.99,11.51 25.07,11.58 | v36.88,11.12 36.96,11.05 | C8.2 66.37,29.11 C7.2 66.37,29.26 65.61,30.02 63.7,30.02 61.65,27.96 61.42,27.96 C9.2 61.27,27.96 60.81,27.96 50.9,37.87 BMP1.P2 | R9.1 66.6,45.26 66.6,45.87 66.9,46.18 IM1.IO19 | R13.1 8.76,77.5 5.79,77.5 5.33,77.95 C10.- 5.71,77.42 5.33,77.04 CON1.1 | R12.1 9.07,63.78 9.83,64.54 14.02,64.54 14.94,63.63 DCDC1.GND 15.77,63.55 15.77,55.24 C11.- 15.85,55.17 23.09,47.93 35.74,47.93 41.38,53.57 41.91,53.57 U$1.P2 | v37.72,44.58 40.46,41.83 43.81,41.83 BMX1.GND
  Bottom 0.254: CON4.3 77.72,6.25 77.19,6.78 v67.06,6.78 66.98,6.86 41.15,6.86 v36.88,11.12 36.88,13.26 34.9,15.24 30.86,15.24 v28.65,13.03 28.35,13.03 28.04,13.34 23.62,13.34 20.23,9.94 | 75.44,26.98 v75.44,28.5 75.51,28.57 75.51,41.76 79.25,45.49 79.25,48.23 79.1,48.39 68.73,48.39 68.28,47.93 IM1.IO18 68.2,47.55 68.2,47.85 67.67,48.39 64.92,48.39 64.47,47.93 IM1.IO24 64.39,47.55 64.39,47.85 63.86,48.39 62.41,48.39 62.26,48.23 | 75.44,26.98 78.79,23.62 78.79,18.75 | 78.79,18.75 77.72,17.68 CON3.3 | 78.79,18.75 79.86,17.68 84.28,17.68 CON5.3 | v66.22,22.1 70.56,22.1 75.44,26.98 | JP3.13 6.4,17.75 11.81,17.75 13.18,16.38 JP2.P$2 | R15.1 20.23,9.94 | 20.23,9.94 16.38,13.79 R16.1 | JP1.14 4.72,14.33 4.72,9.6 5.18,9.14 5.18,4.57 6.33,3.43 6.33,2.59 JP3.19 | BMP1.P2 50.83,37.95 49.61,37.95 46.79,40.77 44.88,40.77 43.89,41.76 BMX1.GND | 62.26,48.23 62.26,45.49 62.41,45.34 66.37,45.34 66.9,45.87 66.9,46.18 IM1.IO19 | 44.2,51.82 45.49,50.52 47.24,50.52 47.85,49.91 47.85,48.54 48.01,48.39 56.24,48.39 56.54,48.69 61.8,48.69 62.26,48.23 | 44.2,51.82 42.44,53.57 41.91,53.57 U$1.P2 | 6.4,63.78 8.99,63.78 R12.1 | 6.4,63.78 5.33,63.78 CON2.1 | CON1.1 5.33,72.01 6.4,70.94 6.4,63.78 | v37.72,44.58 37.95,44.58 42.75,49.38 42.75,50.37 44.2,51.82
  pour Top: -1.27,85.09 88.9,85.09 88.9,-1.27 -1.27,-1.27
  pour Bottom: -1.27,85.09 88.9,85.09 88.9,-1.27 -1.27,-1.27
GPSRX  (via drill 0.35)
  Top 0.152: v67.82,25.6 67.82,6.63 66.22,5.03 48.84,5.03 48.39,5.49 48.39,9.37 U2.24_IO2 | v55.85,44.35 45.03,55.17 38.41,55.17 U$1.P4
  Bottom 0.152: v67.82,25.6 67.82,32.38 v55.85,44.35 | JP3.5 21.34,38.1 U$1.P4
GPSTX  (via drill 0.35)
  Top 0.152: U2.23_IO15 48.31,10.67 47.78,10.67 47.02,9.91 47.02,6.4 48.69,4.72 66.37,4.72 68.43,6.78 68.43,29.18 54.33,43.28 40.08,43.28 v37.87,45.49 37.87,45.41 12.19,45.41 7.47,40.69 6.4,40.69 JP3.4
  Bottom 0.152: v37.87,45.49 37.87,52.12 39.32,53.57 U$1.P3
IMBUSY  (via drill 0.35)
  Top 0.152: v35.05,30.1 39.93,25.22 49.76,25.22 50.75,24.23 50.75,23.7 U2.13_IO14
  Bottom 0.152: v35.05,30.1 30.25,30.1 27.93,27.77 | 27.93,27.77 27.13,26.98 3.28,26.98 2.59,26.29 2.59,21.57 3.81,20.34 JP1.12 | 27.93,27.77 26.75,28.96 26.75,32.69 39.01,44.96 56.16,44.96 56.46,44.65 77.04,44.65 78.33,45.95 78.33,46.18 IM1.IO1
IMRX  (via drill 0.35)
  Top 0.152: v52.43,21.49 52.12,21.18 52.12,6.63 U2.27_IO16 | v52.35,44.35 52.35,45.41 v52.5,45.57 52.35,45.49 50.98,46.86 v37.26,46.86
  Bottom 0.152: v52.43,21.49 52.43,44.27 v52.35,44.35 | v52.5,45.57 61.65,45.57 62.26,44.96 73.53,44.96 74.52,45.95 74.52,46.18 IM1.IO7 | JP3.8 20.88,30.48 v37.26,46.86
IMTX  (via drill 0.35)
  Top 0.152: U2.28_IO17 53.34,7.16 57.65,11.47 | 57.65,11.47 59.51,13.34 62.41,13.34 v66.29,17.22 | v73.61,19.58 75.21,19.58 77.34,21.72 78.56,21.72 84.12,27.28 84.12,27.58 84.73,28.19 85.65,28.19 85.8,28.35 85.8,37.26 79.17,43.89 79.17,48.23 79.1,48.31 76.35,48.31 75.89,47.85 75.89,47.55 IM1.IO6 | v26.21,33.07 48.62,33.07 v53.03,28.65 | v53.26,21.95 53.26,15.85 57.65,11.47
  Bottom 0.152: v66.29,17.22 66.98,17.22 70.26,20.5 72.69,20.5 v73.61,19.58 | v26.21,33.07 21.11,27.96 6.4,27.96 JP3.9 | v53.03,28.65 53.03,22.17 v53.26,21.95
IO0  (via drill 0.35)
  Top 0.254: T2.3 25.91,26.52 25.53,26.9 C3.1 25.91,26.67 SW1.D v27.96,28.73 | U2.25_IO0 49.53,8.31 50.37,9.14 50.37,17.3 51.74,18.67 v51.74,22.1 | v27.36,32.38 22.94,32.38 19.81,35.51 6.4,35.51 JP3.6
  Bottom 0.254: v51.74,22.1 51.74,37.41 51.82,37.49 51.82,40.84 49.45,43.2 39.32,43.2 27.96,31.85 | v27.96,28.73 27.96,31.85 | v27.36,32.38 27.89,31.85 27.96,31.85
IO4  (via drill 0.35)
  Top 0.254: v51.05,16.99 50.83,16.76 50.83,6.63 U2.26_IO4 | v51.05,18.97 51.05,20.04 v50.6,20.5 | v39.55,31.93 27.89,31.93 27.66,31.7 7.7,31.7 6.4,32.99 JP3.7
  Bottom 0.254: v51.05,18.97 v51.05,16.99 | v50.6,20.5 39.55,31.55 v39.55,31.93
IO12
  Top 0.254: U2.14_IO12 49.53,23.7 40.92,23.7 35.2,29.41 28.88,29.41 28.42,29.87 20.34,29.87 9.22,18.75 4.72,18.75 3.81,17.83 JP1.13
IO13  (via drill 0.35)
  Top 0.254: v36.96,18.82 37.64,19.51 48.31,19.51 U2.16_IO13 | v12.8,20.12 v20.73,20.12
  Bottom 0.254: v36.96,18.82 22.02,18.82 v20.73,20.12 | v12.8,20.12 10.9,20.12 10.06,20.95 8.69,20.95 6.48,18.75 5.64,18.75 4.72,17.83 4.72,16.99 3.89,16.15 3.05,16.15 2.9,16 2.9,13.64 3.81,12.72 JP1.15
IO34
  Top 0.254: JP1.5 4.72,37.19 34.37,37.19 36.12,35.43 48.46,35.43 59.66,24.23 59.66,23.7 U2.6_IO34
IO35
  Top 0.254: U2.7_IO35 58.37,23.7 58.37,24.31 48.08,34.59 21.34,34.59 19.43,36.5 4.72,36.5 3.81,35.59 JP1.6
MISO  (via drill 0.35)
  Top 0.152: v70.56,19.89 70.26,20.19 70.26,30.1 70.87,30.71 71.4,30.71 CN1.DAT0 | 57.72,7.73 57.15,7.16 U2.31_IO19 | 57.72,7.73 v66.14,16.15 | v9.75,20.27 6.4,20.27 JP3.12 | v13.49,17.75 21.87,17.75 v22.71,16.92 | 57.72,7.73 v56.31,9.14
  Bottom 0.152: v70.56,19.89 70.1,19.89 66.37,16.15 v66.14,16.15 | v9.75,20.27 10.21,20.27 12.72,17.75 v13.49,17.75 | v22.71,16.92 24,15.62 37.64,15.62 44.12,9.14 v56.31,9.14
MODE1
  Top 0.152: R8.2 68.2,46.18 IM1.IO17
MOSI  (via drill 0.35)
  Top 0.152: R10.2 70.03,34.82 71.09,34.82 71.4,35.13 CN1.CMD 71.48,35.13 72.01,35.13 72.69,34.44 72.69,33.07 77.57,28.19 80.47,28.19 80.54,28.12 80.54,26.59 80.47,26.52 79.63,26.52 70.56,17.45 v70.56,14.94 | U2.37_IO23 64.77,9.53 64.81,9.56 | v67.21,11.96 64.81,9.56 | v64.77,9.6 64.81,9.56
  Bottom 0.152: v67.21,11.96 67.59,11.96 v70.56,14.94 | v64.77,9.6 60.58,13.79 41.99,13.79 38.56,17.22 37.19,17.22 36.27,18.14 23.85,18.14 23.7,17.98 19.2,17.98 14.17,12.95 13.26,12.95 12.34,12.04 12.34,10.52 12.42,10.44 14.4,10.44 16.08,8.76 16.08,7.47 13.72,5.11 6.4,5.11 JP3.18
N$1
  Top 0.254: R1.1 30.25,7.16 30.86,7.16 31.24,6.78 L1.AN
N$2
  Top 0.254: R3.2 28.35,23.39 29.34,23.39 T1.1
N$5
  Top 0.254: R2.2 25.07,23.24 24.99,23.32 T2.1
N$8
  Top 0.254: R4.2 31.24,16.54 29.95,16.54 U1.9
N$10
  Top 0.254: U1.11 R5.1
N$11
  Top 0.152: 18.29,67.06 14.86,67.06 14.48,67.44 14.25,67.44 MOS2.S | 18.29,67.06 DCDC1.VIN | 18.29,67.06 D1.C
N$12
  Top 0.152: MOS1.D1 MOS1.D2 | MOS1.D2 11.89,67.59 MOS1.D4 11.89,67.51 12.8,67.51 MOS1.D3 12.88,67.51 13.56,67.51 13.95,67.89 15.24,67.89 | MOS1.D2 | MOS2.D3 16.08,67.51 15.24,67.51 MOS2.D4 15.24,67.59 15.24,67.89 | MOS2.D1 15.24,70.1 | 15.24,70.1 15.24,67.89 | 15.24,70.1 MOS2.D2
N$13
  Top 0.152: 13.26,55.85 13.26,55.24 C11.+ 13.26,55.85 | 13.26,55.85 13.26,63.63 DCDC1.VOUT | SW3.L 5.18,54.86 6.17,55.85 13.26,55.85
N$14
  Top 0.152: MOS3.D3 12.8,71.32 11.89,71.32 MOS3.D4 11.89,71.4 MOS3.D2 | MOS3.D2 MOS3.D1 15.39,73.91 18.9,77.42 R13.2 18.9,77.5 18.9,80.85 R14.1 | MOS3.D2
RTS
  Top 0.254: JP2.P$1 13.26,18.97 19.05,18.97 R15.2 19.13,18.97 24.38,18.97 | 26.44,22.63 26.21,22.86 26.21,23.24 R2.1 | 26.44,22.63 30.56,22.63 31.24,23.32 T1.2 | 24.38,18.97 24.38,20.57 26.44,22.63 | 24.38,18.97 24.38,18.29 24.61,18.06 25.15,18.06 U1.24
RXD  (via drill 0.35)
  Top 0.254: U1.25 24.31,17.53 24.23,17.45 | 24.23,17.45 15.47,8.69 v15.47,8.46 | v60.66,8.91 62.18,7.39 62.18,6.63 U2.35_TXD0 | v24.16,17.53 24.23,17.45
  Bottom 0.254: v15.47,8.46 13.26,6.25 JP2.P$6 13.11,6.25 9.22,10.13 6.4,10.13 JP3.16 | v60.66,8.91 56.16,13.41 41,13.41 37.57,16.84 24.84,16.84 v24.16,17.53
S_VN
  Top 0.254: U2.5_SENSOR_VN 60.96,24.23 49.3,35.89 36.27,35.89 32.92,39.24 5.18,39.24 3.81,40.62 JP1.4
S_VP  (via drill 0.35)
  Top 0.254: v8.53,40.16 32.61,40.16 36.42,36.35 50.14,36.35 62.18,24.31 62.18,23.7 U2.4_SENSOR_VP
  Bottom 0.254: v8.53,40.16 6.48,42.22 4.72,42.22 3.81,43.13 JP1.3
SCK  (via drill 0.35)
  Top 0.152: 69.99,32.04 69.95,32 v69.95,10.13 | 69.99,32.04 70.87,32.92 71.4,32.92 CN1.CLK | v56.31,8.23 56.31,7.01 55.93,6.63 U2.30_IO18 | JP3.11 6.33,22.86 6.33,23.77 4.72,25.38 4.72,26.14 3.81,27.05 3.05,27.05 2.9,27.2 2.9,56.92 8.08,62.1 8.08,64.08 8.91,64.92 16.08,64.92 17.37,63.63 17.37,62.94 23.09,57.23 44.5,57.23 68.96,32.77 68.96,32.38 69.27,32.08 69.95,32.08 69.99,32.04
  Bottom 0.152: v69.95,10.13 66.22,10.13 64.31,8.23 v56.31,8.23
SCL  (via drill 0.35)
  Top 0.152: v66.9,25.15 66.9,16 63.55,12.65 63.55,6.63 U2.36_IO22
  Bottom 0.152: v66.9,25.15 66.9,25.98 64.54,28.35 57.91,28.35 53.87,24.31 53.87,21.64 53.11,20.88 52.05,20.88 50.6,22.33 50.6,35.66 48.39,37.87 BMP1.P3 48.31,37.95 47.47,38.79 42.82,38.79 | 42.82,38.79 38.71,38.79 37.26,37.34 37.26,30.02 33.91,26.67 3.43,26.67 2.9,26.14 2.9,24.69 3.05,24.54 3.73,24.54 4.72,23.55 4.72,22.86 5.64,21.95 11.89,21.95 14.1,19.74 14.1,15.62 13.95,15.47 12.72,15.47 9.07,11.81 6.4,11.81 5.49,10.9 5.49,9.37 6.33,8.53 6.33,7.62 JP3.17 | 42.82,38.79 42.82,42.67 42.98,42.82 47.24,42.82 48.23,41.83 48.84,41.83 BMX1.SCL
SD0
  Top 0.254: U2.21_SD0 48.31,13.18 47.7,13.18 46.63,12.12 46.63,6.25 48.54,4.34 66.52,4.34 68.81,6.63 68.81,29.34 54.48,43.66 40.69,43.66 38.18,46.18 6.86,46.18 6.4,45.72 JP3.2
SD1  (via drill 0.35)
  Top 0.254: v48.23,21.87 49.15,21.87 49.61,21.41 49.61,12.65 48.92,11.96 48.39,11.96 U2.22_SD1 | v37.87,37.03 36.35,37.03 32.54,40.84 v9.14,40.84
  Bottom 0.254: v48.23,21.87 48.23,22.25 37.87,32.61 v37.87,37.03 | v9.14,40.84 8.69,40.84 JP3.3
SD2
  Top 0.254: U2.17_SD2 48.31,18.29 38.56,18.29 34.52,14.25 33.45,14.25 32.31,13.11 32.31,11.81 31.24,10.74 29.03,10.74 27.36,9.07 23.77,9.07 16.99,2.29 12.27,2.29 7.32,7.24 7.32,8.38 6.48,9.22 4.72,9.22 3.81,10.13 JP1.16
SD3  (via drill 0.35)
  Top 0.254: v40.08,17.07 48.31,17.07 U2.18_SD3 | v17.37,17.07 17.37,11.35 14.78,8.76 14.78,5.41 v14.86,5.33
  Bottom 0.254: v40.08,17.07 39.7,17.07 35.28,21.49 18.67,21.49 17.37,20.19 v17.37,17.07 | v14.86,5.33 14.48,5.33 13.79,4.65 10.13,4.65 7.09,1.6 5.56,1.6 4.72,2.44 4.72,6.71 JP1.17
SDA  (via drill 0.35)
  Top 0.152: U2.33_IO21 59.66,6.55 59.66,6.1 58.9,5.33 49,5.33 48.84,5.49 48.84,8.15 49.99,9.3 v49.99,22.1 49.84,22.25 49.07,22.25 48.84,22.48 47.93,22.48 47.32,21.87 v45.95,21.87 | JP3.14 9.45,15.24 v11.43,13.26 | BMX1.SDA 46.33,41.76 46.33,38.48 45.8,37.95 BMP1.P4
  Bottom 0.152: v49.99,22.1 49.99,33.68 45.8,37.87 BMP1.P4 | v11.43,13.26 11.43,13.72 12.88,15.16 14.1,15.16 16.99,18.06 16.99,20.34 18.52,21.87 v45.95,21.87
SS  (via drill 0.35)
  Top 0.152: v76.43,32.54 72.77,36.2 71.48,36.2 CN1.CD/DAT3 | v55.4,8.23 55.4,7.92 54.63,7.16 54.63,6.63 U2.29_IO5 | v18.97,20.8 v16.69,23.09
  Bottom 0.152: v76.43,32.54 85.65,23.32 85.65,10.29 85.11,9.75 70.56,9.75 | 70.56,9.75 70.48,9.75 68.35,7.62 56.01,7.62 v55.4,8.23 | v16.69,23.09 14.4,25.38 6.4,25.38 JP3.10 | v18.97,20.8 19.13,20.8 21.49,18.44 36.42,18.44 37.34,17.53 38.71,17.53 42.14,14.1 63.7,14.1 67.06,10.74 70.26,10.74 70.56,10.44 70.56,9.75
STATUS
  Top 0.152: R9.2 65.99,45.26 65.99,45.87 65.68,46.18 IM1.IO21
SV1  (via drill 0.35)
  Top 0.152: v55.7,25.22 53.11,25.22 52.12,24.23 52.12,23.7 U2.12_IO27 52.12,24.31 50.9,25.53 45.72,25.53 40.54,30.71 20.65,30.71 11.89,21.95 5.64,21.95 4.72,22.86 JP1.11
  Bottom 0.152: v55.7,25.22 60.73,25.22 64.47,21.49 76.5,21.49 77.72,22.71 CON3.1
SV2  (via drill 0.35)
  Top 0.152: U2.11_IO26 53.34,23.09 v56.24,20.19
  Bottom 0.152: CON4.1 77.72,11.35 66.9,11.35 58.06,20.19 v56.24,20.19 55.63,19.58 49.15,19.58 46.25,22.48 16.38,22.48 15.09,23.77 6.33,23.77 4.72,25.38 3.81,25.38 JP1.10
SV3  (via drill 0.35)
  Top 0.152: 57.34,20.38 57.84,19.89 v61.49,19.89 | 57.34,20.38 54.63,23.09 54.63,23.62 U2.10_IO25 | v14.17,26.06 13.95,26.29 6.4,26.29 4.8,27.89 3.81,27.89 JP1.9 | v37.11,20.95 v34.37,23.7 | v54.41,15.62 54.41,17.45 57.34,20.38
  Bottom 0.152: v61.49,19.89 65.84,15.54 77.5,15.54 82.75,10.29 85.19,10.29 85.34,10.44 85.34,21.72 CON5.1 | v14.17,26.06 16.54,23.7 v34.37,23.7 | v37.11,20.95 41.38,16.69 41.38,16 41.76,15.62 v54.41,15.62
SV4  (via drill 0.35)
  Top 0.152: v58.14,20.8 55.93,23.01 55.93,23.62 U2.9_IO33 | JP1.8 4.72,30.48 6.4,28.8 12.34,28.8 v15.09,26.06
  Bottom 0.152: CON6.1 84.28,11.35 82.14,11.35 76.73,16.76 76.73,17.37 73.3,20.8 v58.14,20.8 55.93,20.8 55.02,19.89 49.3,19.89 43.13,26.06 v15.09,26.06
TXD  (via drill 0.35)
  Top 0.254: 24.08,16.46 17.37,9.75 17.37,3.28 16.84,2.74 12.42,2.74 12.27,2.9 12.27,7.85 | 24.08,16.46 24.61,16.99 25.15,16.99 U1.26 | 12.27,7.85 13.18,8.76 JP2.P$5 | U2.34_RXD0 60.96,7.62 v59.74,8.84 | v24.16,16.38 24.08,16.46 | 12.27,7.85 7.47,12.65 6.4,12.65 JP3.15
  Bottom 0.254: v59.74,8.84 57.61,8.84 53.49,12.95 40.84,12.95 37.41,16.38 v24.16,16.38

### Text on the board
tPlace: 3v3 | CLK | EN | SD0 | SVP | SD1 | SVN | GPSTX | IO34 | GPSRX | IO35 | IO0 | FC | IO4 | SV4 | IMRX | SV3 | IMTX | SV2 | SS | SV1 | SCK | IMB | MISO | RTS | IO12 | GND | GND | GND | SDA | CTS | IO13 | TXD | 3V3 | SD2 | RXD | TXD | SD3 | SCL | RXD | CMD | MOSI | 5V | GND | DTR